# Altium project ESP32.PrjPcb
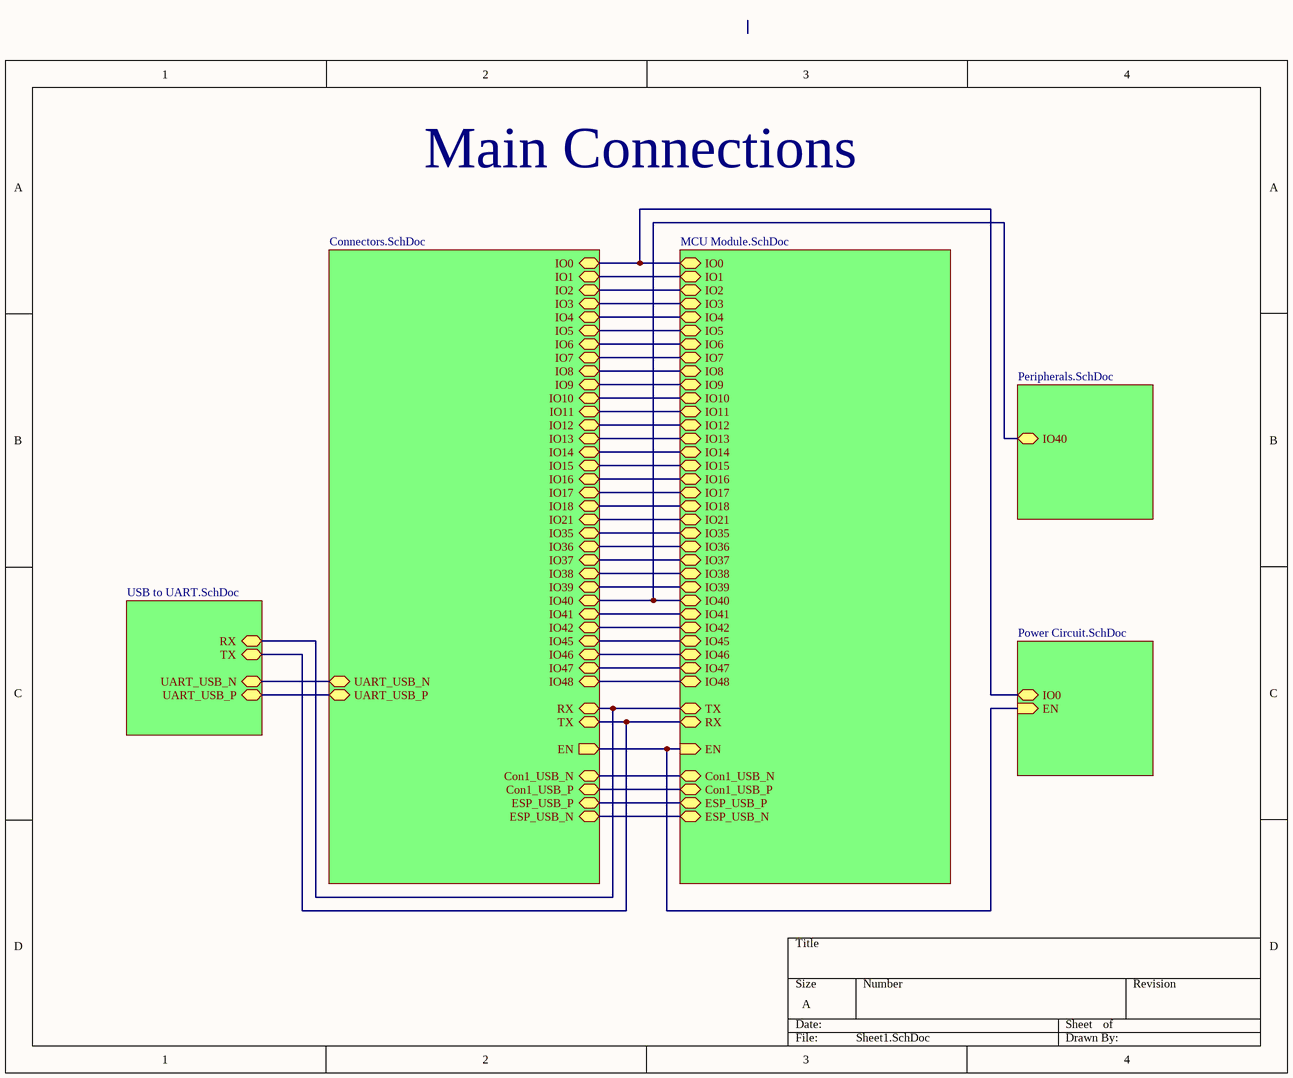
[diagram p0: Sheet1.SchDoc]
6 sheets, 50 parts. Net scope: hierarchical (ports join the sheet entries above them; power ports are global).
Board file: PCB1.PcbDoc
Sheets:
  Sheet1.SchDoc
    Designator = MCU Module.SchDoc
    Designator = Peripherals.SchDoc
    Designator = Power Circuit.SchDoc
    Designator = USB to UART.SchDoc
    Designator = Connectors.SchDoc

## Sheet Sheet1.SchDoc
size A; SheetNumber: 1; SheetTotal: 6

### Sub-sheets
Designator = MCU Module.SchDoc: IO0 (bidir), IO1 (bidir), IO2 (bidir), IO3 (bidir), IO4 (bidir), IO5 (bidir), IO6 (bidir), IO7 (bidir), IO8 (bidir), IO9 (bidir), IO10 (bidir), IO11 (bidir), IO12 (bidir), IO13 (bidir), IO14 (bidir), IO15 (bidir), IO16 (bidir), IO17 (bidir), IO18 (bidir), Con1_USB_P (bidir), Con1_USB_N (bidir), IO21 (bidir), IO35 (bidir), IO36 (bidir), IO37 (bidir), IO38 (bidir), IO39 (bidir), IO40 (bidir), IO41 (bidir), IO42 (bidir), IO45 (bidir), IO46 (bidir), IO47 (bidir), IO48 (bidir), TX (bidir), RX (bidir), EN (in), ESP_USB_P (bidir), ESP_USB_N (bidir)
Designator = Peripherals.SchDoc: IO40 (bidir)
Designator = Power Circuit.SchDoc: IO0 (bidir), EN (in)
Designator = USB to UART.SchDoc: RX (bidir), TX (bidir), UART_USB_N (bidir), UART_USB_P (bidir)
Designator = Connectors.SchDoc: IO0 (bidir), IO1 (bidir), IO2 (bidir), IO3 (bidir), IO4 (bidir), IO5 (bidir), IO6 (bidir), IO7 (bidir), IO8 (bidir), IO9 (bidir), IO10 (bidir), IO11 (bidir), IO12 (bidir), IO13 (bidir), IO14 (bidir), IO15 (bidir), IO16 (bidir), IO17 (bidir), IO18 (bidir), IO21 (bidir), IO35 (bidir), IO36 (bidir), IO37 (bidir), IO38 (bidir), IO39 (bidir), IO40 (bidir), IO41 (bidir), IO42 (bidir), IO45 (bidir), IO46 (bidir), IO47 (bidir), IO48 (bidir), RX (bidir), TX (bidir), EN (out), Con1_USB_P (bidir), Con1_USB_N (bidir), ESP_USB_P (bidir), ESP_USB_N (bidir), UART_USB_N (bidir), UART_USB_P (bidir)

### Nets
Con1_USB_N: sheet Designator/Con1_USB_N, sheet Designator/ESP_USB_N, sheet Designator/Con1_USB_N, sheet Designator/ESP_USB_N
Con1_USB_P: sheet Designator/Con1_USB_P, sheet Designator/ESP_USB_P, sheet Designator/Con1_USB_P, sheet Designator/ESP_USB_P
EN: sheet Designator/EN, sheet Designator/EN, sheet Designator/EN
IO0: sheet Designator/IO0, sheet Designator/IO0, sheet Designator/IO0
IO1: sheet Designator/IO1, sheet Designator/IO1
IO2: sheet Designator/IO2, sheet Designator/IO2
IO3: sheet Designator/IO3, sheet Designator/IO3
IO4: sheet Designator/IO4, sheet Designator/IO4
IO5: sheet Designator/IO5, sheet Designator/IO5
IO6: sheet Designator/IO6, sheet Designator/IO6
IO7: sheet Designator/IO7, sheet Designator/IO7
IO8: sheet Designator/IO8, sheet Designator/IO8
IO9: sheet Designator/IO9, sheet Designator/IO9
IO10: sheet Designator/IO10, sheet Designator/IO10
IO11: sheet Designator/IO11, sheet Designator/IO11
IO12: sheet Designator/IO12, sheet Designator/IO12
IO13: sheet Designator/IO13, sheet Designator/IO13
IO14: sheet Designator/IO14, sheet Designator/IO14
IO15: sheet Designator/IO15, sheet Designator/IO15
IO16: sheet Designator/IO16, sheet Designator/IO16
IO17: sheet Designator/IO17, sheet Designator/IO17
IO18: sheet Designator/IO18, sheet Designator/IO18
IO21: sheet Designator/IO21, sheet Designator/IO21
IO35: sheet Designator/IO35, sheet Designator/IO35
IO36: sheet Designator/IO36, sheet Designator/IO36
IO37: sheet Designator/IO37, sheet Designator/IO37
IO38: sheet Designator/IO38, sheet Designator/IO38
IO39: sheet Designator/IO39, sheet Designator/IO39
IO40: sheet Designator/IO40, sheet Designator/IO40, sheet Designator/IO40
IO41: sheet Designator/IO41, sheet Designator/IO41
IO42: sheet Designator/IO42, sheet Designator/IO42
IO45: sheet Designator/IO45, sheet Designator/IO45
IO46: sheet Designator/IO46, sheet Designator/IO46
IO47: sheet Designator/IO47, sheet Designator/IO47
IO48: sheet Designator/IO48, sheet Designator/IO48
RX: sheet Designator/RX, sheet Designator/TX, sheet Designator/TX
RX: sheet Designator/TX, sheet Designator/RX, sheet Designator/RX  [a separate net that carries the same name]
UART_USB_N: sheet Designator/UART_USB_N, sheet Designator/UART_USB_N
UART_USB_P: sheet Designator/UART_USB_P, sheet Designator/UART_USB_P

### Notes on the sheet
- Main Connections

## Sheet MCU Module.SchDoc
size A; SheetNumber: 1; SheetTotal: 5
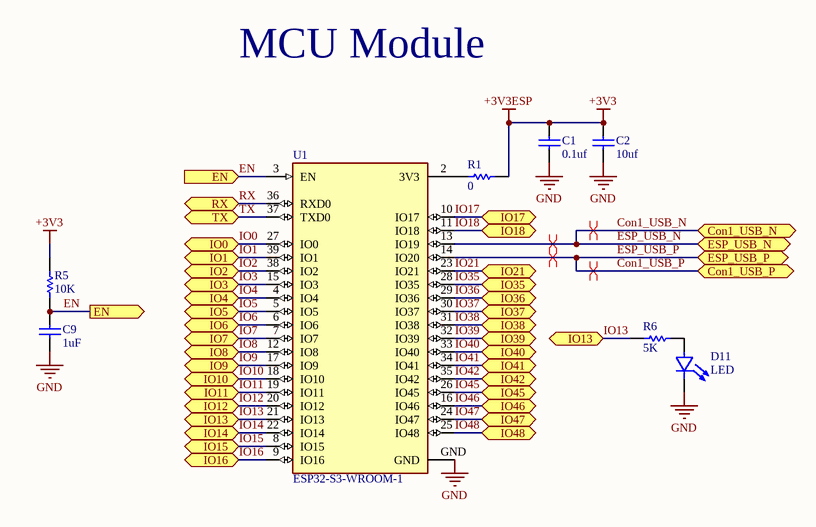
[diagram p1: MCU Module.SchDoc]

### Parts
C1  0.1uf  [C0402]
C2  10uf  [C0402]
C9  1uF  [C0402]
D11  LED  [LED0402]
R1  0  [R0402]
R5  10K  [R0402]
R6  5K  [R0402]
U1  ESP32-S3-WROOM-1  [ESP32]

### Ports
Con1_USB_N (bidir, see Connectors[2B], Connectors[3B]), Con1_USB_P (bidir, see Connectors[2B], Connectors[3B]), EN (in, see Connectors[1A], MCU Module[2C], Power Circuit[2C], USB to UART[4B]), EN (out, see Connectors[1A], MCU Module[2B], Power Circuit[2C], USB to UART[4B]), ESP_USB_N (bidir, see Connectors[4B]), ESP_USB_P (bidir, see Connectors[4B]), IO0 (bidir, see Connectors[4B], Power Circuit[3C], USB to UART[4C]), IO1 (bidir, see Connectors[4B]), IO2 (bidir, see Connectors[4B]), IO3 (bidir, see Connectors[1B]), IO4 (bidir, see Connectors[1B]), IO5 (bidir, see Connectors[1B]), IO6 (bidir, see Connectors[1B]), IO7 (bidir, see Connectors[1B]), IO8 (bidir, see Connectors[1B]), IO9 (bidir, see Connectors[1B]), IO10 (bidir, see Connectors[1B]), IO11 (bidir, see Connectors[1B]), IO12 (bidir, see Connectors[1B]), IO13 (bidir, see Connectors[1B], MCU Module[2C]), IO13 (bidir, see Connectors[1B], MCU Module[3C]), IO14 (bidir, see Connectors[1B]), IO15 (bidir, see Connectors[1B]), IO16 (bidir, see Connectors[1B]), IO17 (bidir, see Connectors[1B]), IO18 (bidir, see Connectors[1B]), IO21 (bidir, see Connectors[4B]), IO35 (bidir, see Connectors[4B]), IO36 (bidir, see Connectors[4B]), IO37 (bidir, see Connectors[4B]), IO38 (bidir, see Connectors[4B]), IO39 (bidir, see Connectors[4B]), IO40 (bidir, see Connectors[4B], Peripherals[2B]), IO41 (bidir, see Connectors[4B]), IO42 (bidir, see Connectors[4B]), IO45 (bidir, see Connectors[4B]), IO46 (bidir, see Connectors[1B]), IO47 (bidir, see Connectors[4B]), IO48 (bidir, see Connectors[4B]), RX (bidir, see Connectors[4A], USB to UART[3B]), TX (bidir, see Connectors[4A], USB to UART[3B])

### Nets
+3V3: C1.01(+) C2.01(+) R1.01 R5.02  [also labelled +3V3ESP]
GND: C1.02(-) C2.02(-) C9.01(+) D11.1(C) U1.GND
Con1_USB_N: U1.13(IO19) ; port ESP_USB_N, port Con1_USB_N  [also labelled ESP_USB_N]
Con1_USB_P: U1.14(IO20) ; port ESP_USB_P, port Con1_USB_P  [also labelled ESP_USB_P]
EN: C9.02(-) R5.01 U1.3(EN) ; port EN
IO0: U1.27(IO0) ; port IO0
IO1: U1.39(IO1) ; port IO1
IO2: U1.38(IO2) ; port IO2
IO3: U1.15(IO3) ; port IO3
IO4: U1.4(IO4) ; port IO4
IO5: U1.5(IO5) ; port IO5
IO6: U1.6(IO6) ; port IO6
IO7: U1.7(IO7) ; port IO7
IO8: U1.12(IO8) ; port IO8
IO9: U1.17(IO9) ; port IO9
IO10: U1.18(IO10) ; port IO10
IO11: U1.19(IO11) ; port IO11
IO12: U1.20(IO12) ; port IO12
IO13: R6.02 U1.21(IO13) ; port IO13
IO14: U1.22(IO14) ; port IO14
IO15: U1.8(IO15) ; port IO15
IO16: U1.9(IO16) ; port IO16
IO17: U1.10(IO17) ; port IO17
IO18: U1.11(IO18) ; port IO18
IO21: U1.23(IO21) ; port IO21
IO35: U1.28(IO35) ; port IO35
IO36: U1.29(IO36) ; port IO36
IO37: U1.30(IO37) ; port IO37
IO38: U1.31(IO38) ; port IO38
IO39: U1.32(IO39) ; port IO39
IO40: U1.33(IO40) ; port IO40
IO41: U1.34(IO41) ; port IO41
IO42: U1.35(IO42) ; port IO42
IO45: U1.26(IO45) ; port IO45
IO46: U1.16(IO46) ; port IO46
IO47: U1.24(IO47) ; port IO47
IO48: U1.25(IO48) ; port IO48
RX: U1.36(RXD0) ; port RX
TX: U1.37(TXD0) ; port TX  [project net RX]
NetD11_2: D11.2(A) R6.01
NetR1_02: R1.02 U1.2(3V3)

### Layout directives
differential pair; differential pair class DIFF90: Con1_USB_N, Con1_USB_P

### Notes on the sheet
- MCU Module

### Library data of the parts
C1 C2 C9 = Cap
R1 R5 R6 = Res
U1 = ESP32-S3-WROOM-1: Bluetooth, WiFi 802.11b/g/n, Bluetooth v5.0 Transceiver Module 2.4GHz PCB Trace Surface Mount

## Sheet Peripherals.SchDoc
size A; SheetNumber: 4; SheetTotal: 6
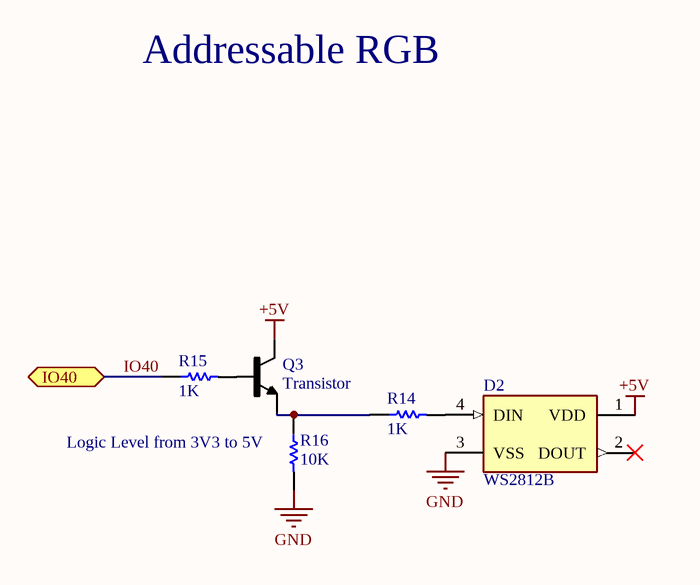
[diagram p2: Peripherals.SchDoc]

### Parts
D2  WS2812B  [WS28128B]
Q3  Transistor  [Transistor]
R14  1K  [R0402]
R15  1K  [R0402]
R16  10K  [R0402]

### Ports
IO40 (bidir, see Sheet1[4B], Connectors[4B], MCU Module[3C])

### Nets
+5V: D2.1(VDD) Q3.3(C)
GND: D2.3(VSS) R16.01
IO40: R15.02 ; port IO40
NetD2_4: D2.4(DIN) R14.01
NetQ3_1: Q3.1(B) R15.01
NetQ3_2: Q3.2(E) R14.02 R16.02

Not connected (* = marked no-connect by the designer): D2 2(DOUT)*

### Notes on the sheet
- Addressable RGB
- (near R16) Logic Level from 3V3 to 5V

### Library data of the parts
D2 = WS2812B: Intelligent control LED integrated light source
R14-R16 = Res

## Sheet Power Circuit.SchDoc
size A; SheetNumber: 5; SheetTotal: 6
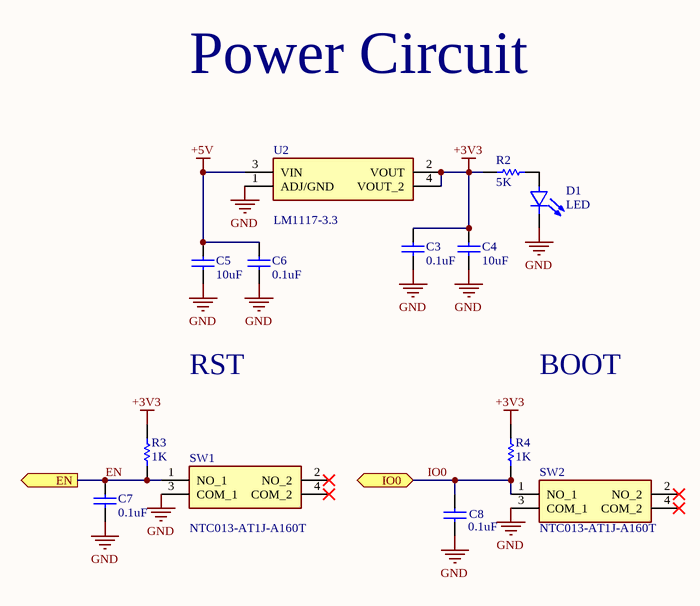
[diagram p3: Power Circuit.SchDoc]

### Parts
C3  0.1uF  [C0402]
C4  10uF  [C0402]
C5  10uF  [C0402]
C6  0.1uF  [C0402]
C7  0.1uF  [C0402]
C8  0.1uF  [C0402]
D1  LED  [LED0402]
R2  5K  [R0402]
R3  1K  [R0402]
R4  1K  [R0402]
SW1  NTC013-AT1J-A160T  [Tactile sw]
SW2  NTC013-AT1J-A160T  [Tactile sw]
U2  LM1117-3.3  [SOT223]

### Ports
EN (out, see Sheet1[4C], Connectors[1A], MCU Module[2B], MCU Module[2C]), IO0 (bidir, see Sheet1[4C], Connectors[4B], MCU Module[2B])

### Nets
+3V3: C3.02(-) C4.02(-) R2.02 R3.02 R4.02 U2.2(VOUT) U2.4(VOUT_2)
+5V: C5.02(-) C6.02(-) U2.3(VIN)
GND: C3.01(+) C4.01(+) C5.01(+) C6.01(+) C7.01(+) C8.01(+) D1.1(C) SW1.3(COM_1) SW2.3(COM_1) U2.1(ADJ/GND)
EN: C7.02(-) R3.01 SW1.1(NO_1) ; port EN
IO0: C8.02(-) R4.01 SW2.1(NO_1) ; port IO0
NetD1_2: D1.2(A) R2.01

Not connected (* = marked no-connect by the designer): SW1 2(NO_2)* 4(COM_2)*; SW2 2(NO_2)* 4(COM_2)*

### Notes on the sheet
- Power Circuit
- RST
- BOOT

### Library data of the parts
C3-C8 = Cap
R2-R4 = Res
U2 = LM1117-3.3: Linear Voltage Regulator IC Positive Fixed 1 Output 800mA DDPAK/TO-263-3

## Sheet USB to UART.SchDoc
size A; SheetNumber: 6; SheetTotal: 6
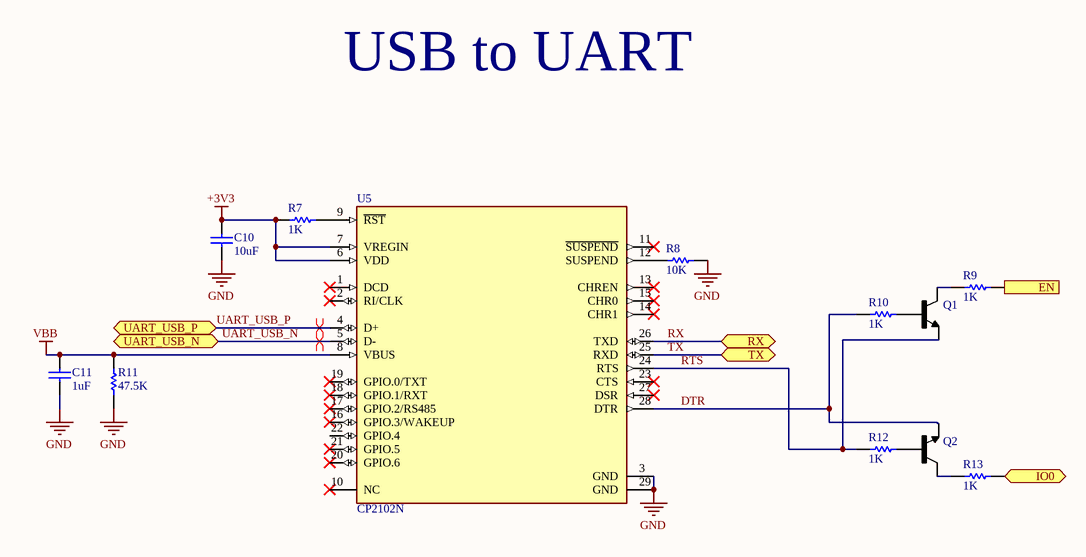
[diagram p4: USB to UART.SchDoc]

### Parts
C10  10uF  [C0402]
C11  1uF  [C0402]
Q1  Transistor  [Transistor]  (value not drawn)
Q2  Transistor  [Transistor]  (value not drawn)
R7  1K  [R0402]
R8  10K  [R0402]
R9  1K  [R0402]
R10  1K  [R0402]
R11  47.5K  [R0402]
R12  1K  [R0402]
R13  1K  [R0402]
U5  CP2102N  [QFN28]

### Ports
EN (out), IO0 (bidir), RX (bidir, see Sheet1[1C], Connectors[4A]), TX (bidir, see Sheet1[1C], Connectors[4A]), UART_USB_N (bidir, see Sheet1[1C], Connectors[1C], Connectors[3C]), UART_USB_P (bidir, see Sheet1[1C], Connectors[1C], Connectors[3C])

### Nets
+3V3: C10.02(-) R7.02 U5.6(VDD) U5.7(VREGIN)
GND: C10.01(+) C11.01(+) R8.01 R11.01 U5.3(GND) U5.29(GND)
VBB: C11.02(-) R11.02 U5.8(VBUS)
DTR: Q2.2(E) R10.02 U5.28(DTR)
RTS: Q1.2(E) R12.02 U5.24(RTS)
RX: U5.26(TXD) ; port RX
TX: U5.25(RXD) ; port TX  [project net RX]
UART_USB_N: U5.5(D-) ; port UART_USB_N
UART_USB_P: U5.4(D+) ; port UART_USB_P
NetQ1_1: Q1.1(B) R10.01
NetQ1_3: Q1.3(C) R9.02
NetQ2_1: Q2.1(B) R12.01
NetQ2_3: Q2.3(C) R13.02
NetR7_01: R7.01 U5.9(~{RST})
NetR8_02: R8.02 U5.12(SUSPEND)
NetR9_01: R9.01 ; port EN
NetR13_01: R13.01 ; port IO0

Not connected (* = marked no-connect by the designer): U5 1(DCD)* 2(RI/CLK)* 10(NC)* 11(~{SUSPEND})* 13(CHREN)* 14(CHR1)* 15(CHR0)* 16(GPIO.3/WAKEUP)* 17(GPIO.2/RS485)* 18(GPIO.1/RXT)* 19(GPIO.0/TXT)* 20(GPIO.6)* 21(GPIO.5)* 22(GPIO.4) 23(CTS)* 27(DSR)*

### Layout directives
differential pair; differential pair class DIFF90: UART_USB_N, UART_USB_P

### Notes on the sheet
- USB to UART

### Library data of the parts
C10 C11 = Cap
R7-R13 = Res
U5 = CP2102N: USB Bridge, USB to UART USB 2.0 UART Interface 28-QFN (5x5)

## Sheet Connectors.SchDoc
size A; SheetNumber: 2; SheetTotal: 5
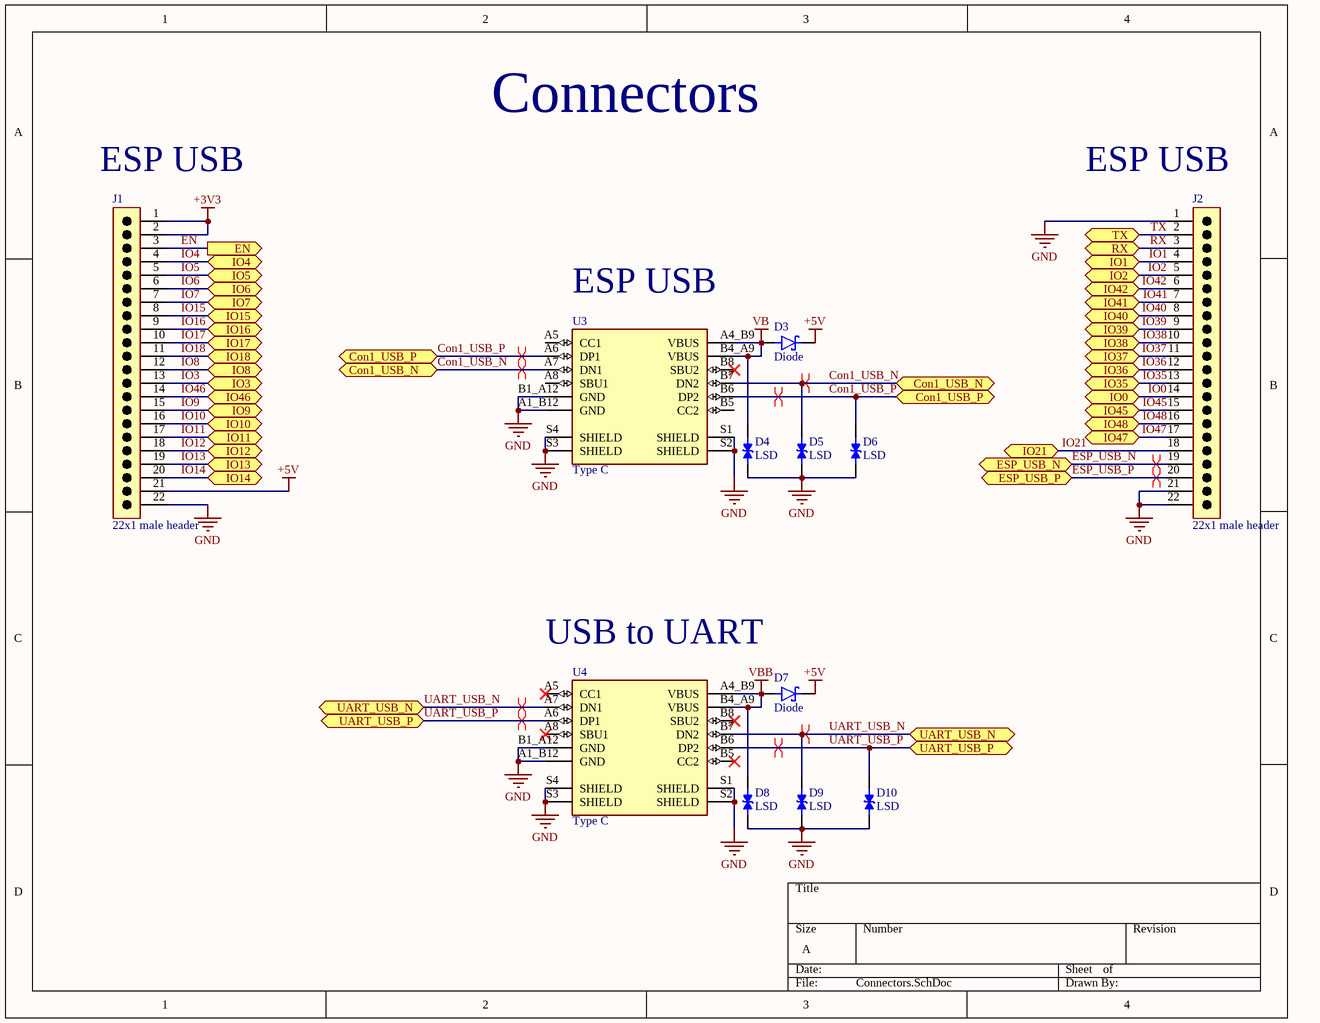
[diagram p5: Connectors.SchDoc]

### Parts
D3  Diode  [Diode]
D4  LSD  [LSD]
D5  LSD  [LSD]
D6  LSD  [LSD]
D7  Diode  [Diode]
D8  LSD  [LSD]
D9  LSD  [LSD]
D10  LSD  [LSD]
J1  22x1 male header  [PCBComponent_1]
J2  22x1 male header  [PCBComponent_1]
U3  Type C  [Type C]
U4  Type C  [Type C]

### Ports
Con1_USB_N (bidir, see Connectors[2B], MCU Module[3B]), Con1_USB_N (bidir, see Connectors[3B], MCU Module[3B]), Con1_USB_P (bidir, see Connectors[2B], MCU Module[3B]), Con1_USB_P (bidir, see Connectors[3B], MCU Module[3B]), EN (out, see MCU Module[2B], MCU Module[2C], Power Circuit[2C], USB to UART[4B]), ESP_USB_N (bidir, see MCU Module[3B]), ESP_USB_P (bidir, see MCU Module[3B]), IO0 (bidir, see MCU Module[2B], Power Circuit[3C], USB to UART[4C]), IO1 (bidir, see MCU Module[2B]), IO2 (bidir, see MCU Module[2B]), IO3 (bidir, see MCU Module[2B]), IO4 (bidir, see MCU Module[2C]), IO5 (bidir, see MCU Module[2C]), IO6 (bidir, see MCU Module[2C]), IO7 (bidir, see MCU Module[2C]), IO8 (bidir, see MCU Module[2C]), IO9 (bidir, see MCU Module[2C]), IO10 (bidir, see MCU Module[2C]), IO11 (bidir, see MCU Module[2C]), IO12 (bidir, see MCU Module[2C]), IO13 (bidir, see MCU Module[2C], MCU Module[3C]), IO14 (bidir, see MCU Module[2C]), IO15 (bidir, see MCU Module[2C]), IO16 (bidir, see MCU Module[2C]), IO17 (bidir, see MCU Module[3B]), IO18 (bidir, see MCU Module[3B]), IO21 (bidir, see MCU Module[3B]), IO35 (bidir, see MCU Module[3B]), IO36 (bidir, see MCU Module[3C]), IO37 (bidir, see MCU Module[3C]), IO38 (bidir, see MCU Module[3C]), IO39 (bidir, see MCU Module[3C]), IO40 (bidir, see MCU Module[3C], Peripherals[2B]), IO41 (bidir, see MCU Module[3C]), IO42 (bidir, see MCU Module[3C]), IO45 (bidir, see MCU Module[3C]), IO46 (bidir, see MCU Module[3C]), IO47 (bidir, see MCU Module[3C]), IO48 (bidir, see MCU Module[3C]), RX (bidir, see MCU Module[2B], USB to UART[3B]), TX (bidir, see MCU Module[2B], USB to UART[3B]), UART_USB_N (bidir, see Connectors[1C], USB to UART[1B]), UART_USB_N (bidir, see Connectors[3C], USB to UART[1B]), UART_USB_P (bidir, see Connectors[1C], USB to UART[1B]), UART_USB_P (bidir, see Connectors[3C], USB to UART[1B])

### Nets
+3V3: J1.1 J1.2
+5V: D3.C(K) D7.C(K) J1.21
GND: D4.1 D5.1 D6.1 D8.1 D9.1 D10.1 J1.22 J2.1 J2.21 J2.22 U3.A1_B12(GND) U3.B1_A12(GND) U3.S1(SHIELD) U3.S2(SHIELD) U3.S3(SHIELD) U3.S4(SHIELD) U4.A1_B12(GND) U4.B1_A12(GND) U4.S1(SHIELD) U4.S2(SHIELD) U4.S3(SHIELD) U4.S4(SHIELD)
VB: D3.A D4.2 U3.A4_B9(VBUS) U3.B4_A9(VBUS)
VBB: D7.A D8.2 U4.A4_B9(VBUS) U4.B4_A9(VBUS)
Con1_USB_N: D5.2 J2.19 U3.A7(DN1) U3.B7(DN2) ; port ESP_USB_N, port Con1_USB_N  [also labelled ESP_USB_N]
Con1_USB_P: D6.2 J2.20 U3.A6(DP1) U3.B6(DP2) ; port ESP_USB_P, port Con1_USB_P  [also labelled ESP_USB_P]
EN: J1.3 ; port EN
IO0: J2.14 ; port IO0
IO1: J2.4 ; port IO1
IO2: J2.5 ; port IO2
IO3: J1.13 ; port IO3
IO4: J1.4 ; port IO4
IO5: J1.5 ; port IO5
IO6: J1.6 ; port IO6
IO7: J1.7 ; port IO7
IO8: J1.12 ; port IO8
IO9: J1.15 ; port IO9
IO10: J1.16 ; port IO10
IO11: J1.17 ; port IO11
IO12: J1.18 ; port IO12
IO13: J1.19 ; port IO13
IO14: J1.20 ; port IO14
IO15: J1.8 ; port IO15
IO16: J1.9 ; port IO16
IO17: J1.10 ; port IO17
IO18: J1.11 ; port IO18
IO21: J2.18 ; port IO21
IO35: J2.13 ; port IO35
IO36: J2.12 ; port IO36
IO37: J2.11 ; port IO37
IO38: J2.10 ; port IO38
IO39: J2.9 ; port IO39
IO40: J2.8 ; port IO40
IO41: J2.7 ; port IO41
IO42: J2.6 ; port IO42
IO45: J2.15 ; port IO45
IO46: J1.14 ; port IO46
IO47: J2.17 ; port IO47
IO48: J2.16 ; port IO48
RX: J2.3 ; port RX
TX: J2.2 ; port TX  [project net RX]
UART_USB_N: D9.2 U4.A7(DN1) U4.B7(DN2) ; port UART_USB_N
UART_USB_P: D10.2 U4.A6(DP1) U4.B6(DP2) ; port UART_USB_P

Not connected (* = marked no-connect by the designer): U3 A5(CC1) A8(SBU1) B5(CC2) B8(SBU2)*; U4 A5(CC1)* A8(SBU1)* B5(CC2)* B8(SBU2)*

### Layout directives
differential pair; differential pair class DIFF90: Con1_USB_N, Con1_USB_P, UART_USB_N, UART_USB_P

### Notes on the sheet
- Connectors
- (near J1) ESP USB
- (near J2) ESP USB
- (near U3) ESP USB
- USB to UART

### Library data of the parts
U3 U4 = Type C: USB Connectors 24 Receptacle 1 8.94*7.3mm RoHS

## Nets that join several sheets
+3V3: MCU Module (C1.01 C2.01 R1.01 R5.02), Power Circuit (7 pins), USB to UART (C10.02 R7.02 U5.6 U5.7), Connectors (J1.1 J1.2)
+5V: Peripherals (D2.1 Q3.3), Power Circuit (C5.02 C6.02 U2.3), Connectors (D3.C D7.C J1.21)
GND: MCU Module (5 pins), Peripherals (D2.3 R16.01), Power Circuit (10 pins), USB to UART (6 pins), Connectors (22 pins)
VBB: USB to UART (C11.02 R11.02 U5.8), Connectors (D7.A D8.2 U4.A4_B9 U4.B4_A9)
Con1_USB_N: MCU Module (U1.13), Connectors (D5.2 J2.19 U3.A7 U3.B7)
Con1_USB_P: MCU Module (U1.14), Connectors (D6.2 J2.20 U3.A6 U3.B6)
EN: MCU Module (C9.02 R5.01 U1.3), Power Circuit (C7.02 R3.01 SW1.1), Connectors (J1.3)
IO0: MCU Module (U1.27), Power Circuit (C8.02 R4.01 SW2.1), Connectors (J2.14)
IO1: MCU Module (U1.39), Connectors (J2.4)
IO2: MCU Module (U1.38), Connectors (J2.5)
IO3: MCU Module (U1.15), Connectors (J1.13)
IO4: MCU Module (U1.4), Connectors (J1.4)
IO5: MCU Module (U1.5), Connectors (J1.5)
IO6: MCU Module (U1.6), Connectors (J1.6)
IO7: MCU Module (U1.7), Connectors (J1.7)
IO8: MCU Module (U1.12), Connectors (J1.12)
IO9: MCU Module (U1.17), Connectors (J1.15)
IO10: MCU Module (U1.18), Connectors (J1.16)
IO11: MCU Module (U1.19), Connectors (J1.17)
IO12: MCU Module (U1.20), Connectors (J1.18)
IO13: MCU Module (R6.02 U1.21), Connectors (J1.19)
IO14: MCU Module (U1.22), Connectors (J1.20)
IO15: MCU Module (U1.8), Connectors (J1.8)
IO16: MCU Module (U1.9), Connectors (J1.9)
IO17: MCU Module (U1.10), Connectors (J1.10)
IO18: MCU Module (U1.11), Connectors (J1.11)
IO21: MCU Module (U1.23), Connectors (J2.18)
IO35: MCU Module (U1.28), Connectors (J2.13)
IO36: MCU Module (U1.29), Connectors (J2.12)
IO37: MCU Module (U1.30), Connectors (J2.11)
IO38: MCU Module (U1.31), Connectors (J2.10)
IO39: MCU Module (U1.32), Connectors (J2.9)
IO40: MCU Module (U1.33), Peripherals (R15.02), Connectors (J2.8)
IO41: MCU Module (U1.34), Connectors (J2.7)
IO42: MCU Module (U1.35), Connectors (J2.6)
IO45: MCU Module (U1.26), Connectors (J2.15)
IO46: MCU Module (U1.16), Connectors (J1.14)
IO47: MCU Module (U1.24), Connectors (J2.17)
IO48: MCU Module (U1.25), Connectors (J2.16)
RX: MCU Module (U1.36), USB to UART (U5.25), Connectors (J2.2)
RX: MCU Module (U1.37), USB to UART (U5.26), Connectors (J2.3)
UART_USB_N: USB to UART (U5.5), Connectors (D9.2 U4.A7 U4.B7)
UART_USB_P: USB to UART (U5.4), Connectors (D10.2 U4.A6 U4.B6)